# Altium schematic sheet IridiumModem.SchDoc: Iridium Modem
size 431 x 279 mm; DocumentNumber: 14; SheetNumber: 14; SheetTotal: 18; ENG_APP_DATE: --/--/--; DSN_APP_DATE: --/--/--; CHK_APP_DATE: --/--/--
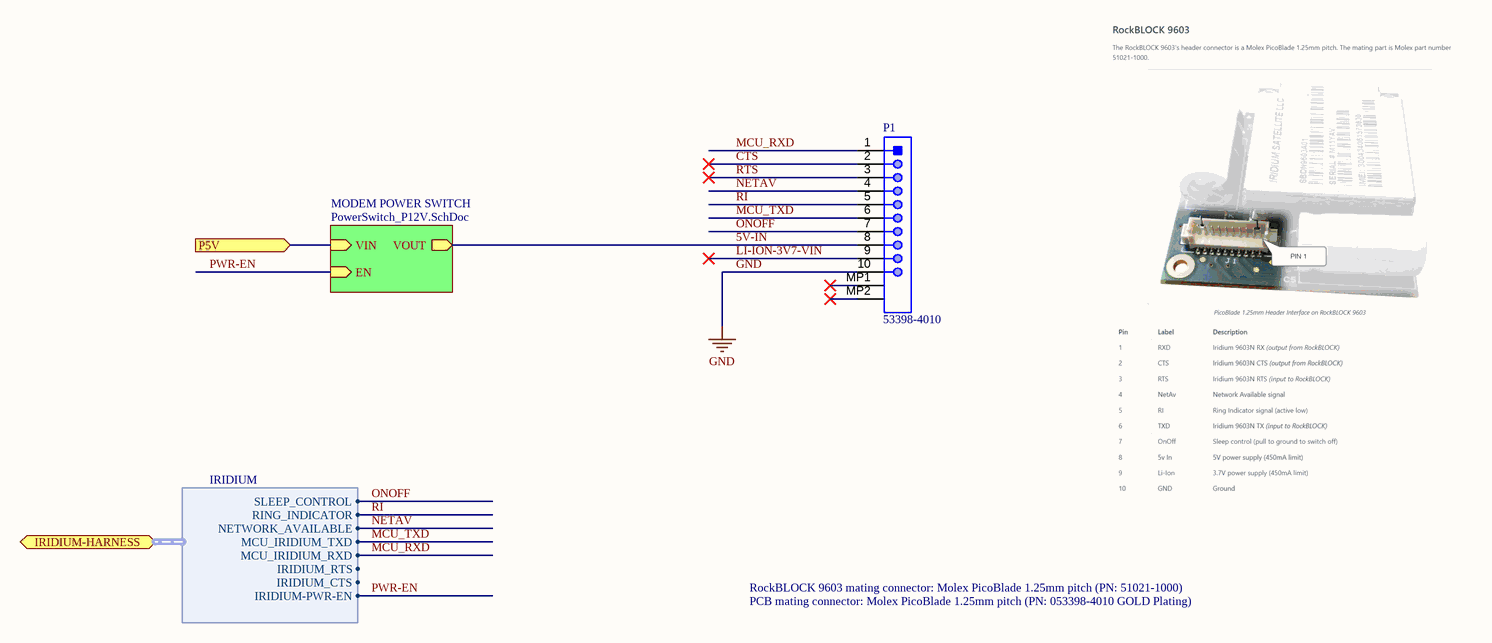
[diagram p0: IridiumModem.SchDoc]

## Parts
P1  53398-4010  [MOLX-53398-1071_V-CROSSOVER]

## Sub-sheets
MODEM POWER SWITCH = PowerSwitch_P12V.SchDoc: VOUT (out), VIN (in), EN (in)

## Ports
IRIDIUM-HARNESS (bidir, harness IRIDIUM), P5V (in)

## Harnesses
IRIDIUM: RING_INDICATOR, SLEEP_CONTROL, IRIDIUM_CTS, IRIDIUM_RTS, MCU_IRIDIUM_RXD, MCU_IRIDIUM_TXD, NETWORK_AVAILABLE, IRIDIUM-PWR-EN

## Nets
GND: P1.10
5V-IN: P1.8 ; sheet MODEM POWER SWITCH/VOUT
CTS: P1.2
LI-ION-3V7-VIN: P1.9
MCU_RXD: P1.1 ; port IRIDIUM-HARNESS.MCU_IRIDIUM_RXD
MCU_TXD: P1.6 ; port IRIDIUM-HARNESS.MCU_IRIDIUM_TXD
NETAV: P1.4 ; port IRIDIUM-HARNESS.NETWORK_AVAILABLE
ONOFF: P1.7 ; port IRIDIUM-HARNESS.SLEEP_CONTROL
P5V: port P5V, sheet MODEM POWER SWITCH/VIN
PWR-EN: sheet MODEM POWER SWITCH/EN, port IRIDIUM-HARNESS.IRIDIUM-PWR-EN
RI: P1.5 ; port IRIDIUM-HARNESS.RING_INDICATOR
RTS: P1.3

Not connected (* = marked no-connect by the designer): P1 MP1* MP2*

## Notes on the sheet
- RockBLOCK 9603 mating connector: Molex PicoBlade 1.25mm pitch (PN: 51021-1000)
- PCB mating connector: Molex PicoBlade 1.25mm pitch (PN: 053398-4010 GOLD Plating)
- THIS DOCUMENT AND THE DATA DISCLOSED HEREIN OR HEREWITH IS THE PROPERTY OF APPLIED PHYSICS LAB - UNIVERSITY OF WASHINGTON.
- PROJECT
- TITLE
- FILE NAME
- SIZE
- B
- CAGE CODE
- DWG NO.
- SHEET
- OF
- REV

## Library data of the parts
P1 = CMP-002-00116-4: Conn Shrouded Header (3 Sides) HDR 10 POS 1.25mm Solder ST Top Entry SMD GOLD Plating PicoBlade™ T/R; Manufacturer: Molex; Number of Circuits: 10; Voltage Rating: 125V; Current Rating: 1A; Pitch: 1.25mm; Mount: Surface Mount; Min Operating Temperature: -40°C; Contact Plating: Gold; Color: Natural; Orientation: Vertical; Series: PicoBlade; Number of Rows: 1; Max Operating Temperature: 85°C; Contact Gender: Male; Case/Package: Header